# EAGLE design car (EAGLE 6.2)
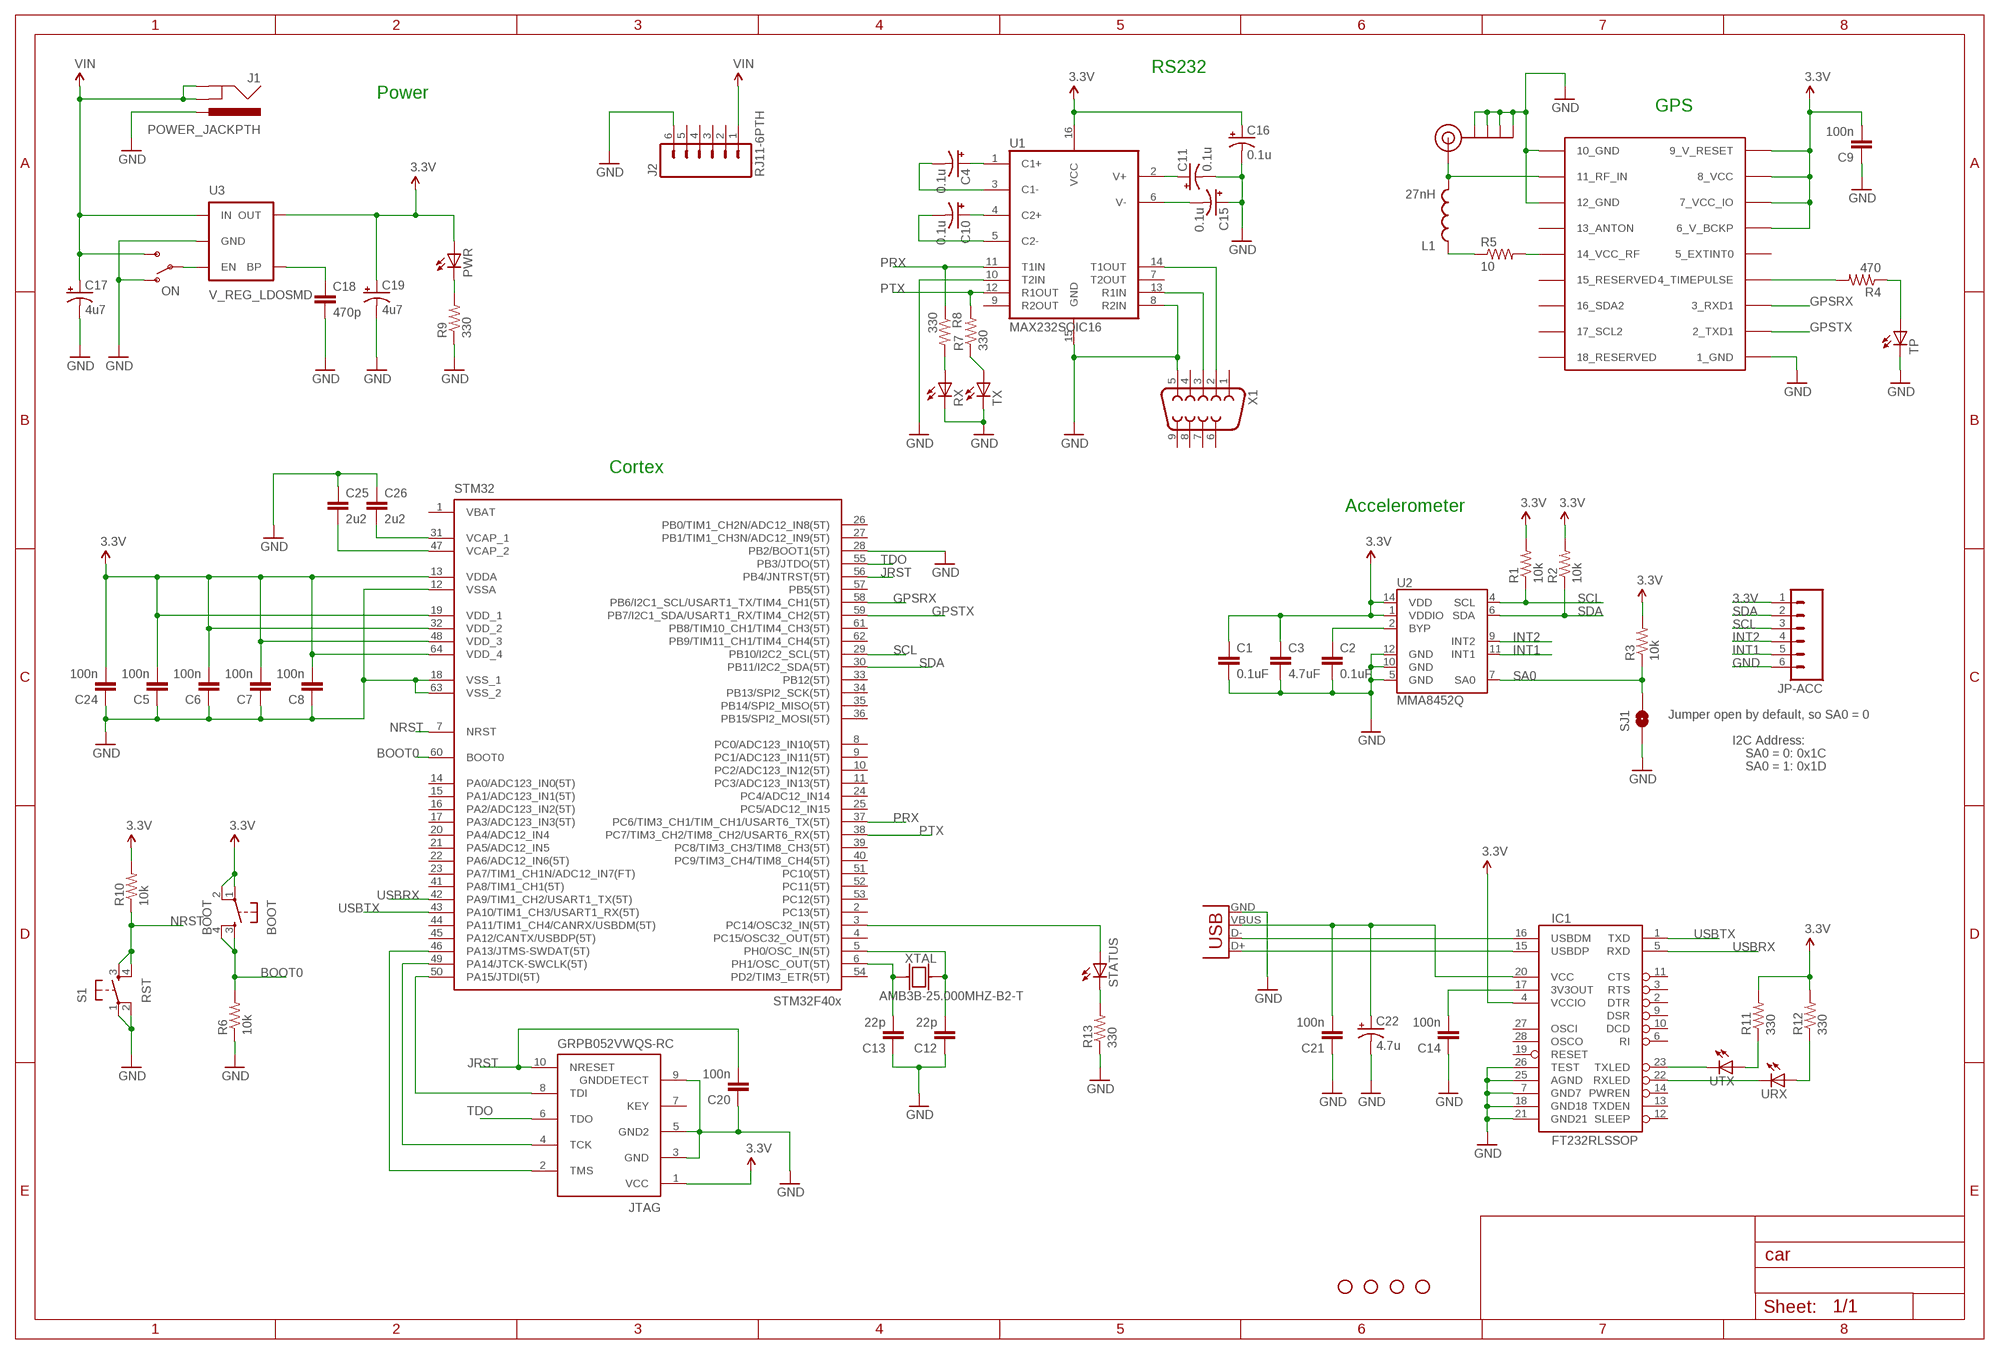
[diagram p0: schematic, sheet 1]

## Parts
BOOT  BOOT  TAC_SWITCHSMD  [TACTILE_SWITCH_SMD]
C1  0.1uF  CAP0603-CAP  [0603-CAP]
C2  0.1uF  CAP0603-CAP  [0603-CAP]
C3  4.7uF  CAP0603-CAP  [0603-CAP]
C4  0.1u  CAP_POL1206  [EIA3216]
C5  100n  CAP0603-CAP  [0603-CAP]
C6  100n  CAP0603-CAP  [0603-CAP]
C7  100n  CAP0603-CAP  [0603-CAP]
C8  100n  CAP0603-CAP  [0603-CAP]
C9  100n  CAP0603-CAP  [0603-CAP]
C10  0.1u  CAP_POL1206  [EIA3216]
C11  0.1u  CAP_POL1206  [EIA3216]
C12  22p  CAP0603-CAP  [0603-CAP]
C13  22p  CAP0603-CAP  [0603-CAP]
C14  100n  CAP0603-CAP  [0603-CAP]
C15  0.1u  CAP_POL1206  [EIA3216]
C16  0.1u  CAP_POL1206  [EIA3216]
C17  4u7  CAP_POL1206  [EIA3216]
C18  470p  CAP0603-CAP  [0603-CAP]
C19  4u7  CAP_POL1206  [EIA3216]
C20  100n  CAP0603-CAP  [0603-CAP]
C21  100n  CAP0603-CAP  [0603-CAP]
C22  4.7u  CAP_POL1206  [EIA3216]
C24  100n  CAP0603-CAP  [0603-CAP]
C25  2u2  CAP0603-CAP  [0603-CAP]
C26  2u2  CAP0603-CAP  [0603-CAP]
IC1  FT232RLSSOP  [SSOP28DB]
J1  POWER_JACKPTH  [POWER_JACK_PTH]
J2  RJ11-6PTH  [RJ11-6]
J$1  SMA_EDGE  [SMA-EDGE]
JP1  STAND-OFF  [STAND-OFF]
JP2  STAND-OFF  [STAND-OFF]
JP3  STAND-OFF  [STAND-OFF]
JP4  STAND-OFF  [STAND-OFF]
JP-ACC  M06SIP  [1X06]
JTAG  GRPB052VWQS-RC  [DEBUG]
L1  27nH  INDUCTOR0603  [0603]
ON  SWITCH-SPDTPTH  [SWITCH-SPDT]
PWR  LED0603  [LED-0603]
R1  10k  RESISTOR0603-RES  [0603-RES]
R2  10k  RESISTOR0603-RES  [0603-RES]
R3  10k  RESISTOR0603-RES  [0603-RES]
R4  470  RESISTOR0603-RES  [0603-RES]
R5  10  RESISTOR0603-RES  [0603-RES]
R6  10k  RESISTOR0603-RES  [0603-RES]
R7  330  RESISTOR0603-RES  [0603-RES]
R8  330  RESISTOR0603-RES  [0603-RES]
R9  330  RESISTOR0603-RES  [0603-RES]
R10  10k  RESISTOR0603-RES  [0603-RES]
R11  330  RESISTOR0603-RES  [0603-RES]
R12  330  RESISTOR0603-RES  [0603-RES]
R13  330  RESISTOR0603-RES  [0603-RES]
RX  LED0603  [LED-0603]
S1  RST  TAC_SWITCHSMD  [TACTILE_SWITCH_SMD]
SJ1  SOLDERJUMPERNO  [SJ_2S-NO]
STATUS  LED0603  [LED-0603]
STM32  STM32F405R  [TQFP64]
TP  LED0603  [LED-0603]
TX  LED0603  [LED-0603]
U1  MAX232SOIC16  [SO016]
U2  MMA8452Q  [QFN-16_0.5MM]
U3  V_REG_LDOSMD  [SOT23-5]
U$1  UBLOX_MAX-6  [UBLOX_MAX-6]
URX  LED0603  [LED-0603]
USB  USB-SMD-NS  [USB-MINIB-NOSTOP]
UTX  LED0603  [LED-0603]
X1  DB9FEMALE  [DB9]
XTAL  AMB3B-25.000MHZ-B2-T  [4LCC]

## Nets
3.3V: BOOT.1 BOOT.2 C1.1 C3.1 C5.2 C6.2 C7.2 C8.2 C9.2 C16.A(+) C19.A(+) C24.2 IC1.4(VCCIO) JP-ACC.1 JTAG.1(VCC) PWR.A R1.2 R2.2 R3.2 R10.2 R11.2 R12.2 STM32.13(VDDA) STM32.19(VDD_1) STM32.32(VDD_2) STM32.48(VDD_3) STM32.64(VDD_4) U1.16(VCC) U2.1(VDDIO) U2.14(VDD) U3.5(OUT) U$1.6_V_BCKP U$1.7_VCC_IO U$1.8_VCC U$1.9_V_RESET
3.3V1: STATUS.A STM32.3(PC14/OSC32_IN(5T))
BOOT0: BOOT.3 BOOT.4 R6.2 STM32.60(BOOT0)
BYP: C2.1 U2.2(BYP)
GND: C1.2 C2.2 C3.2 C5.1 C6.1 C7.1 C8.1 C9.1 C11.C(-) C12.1 C13.1 C14.1 C15.A(+) C16.C(-) C17.C(-) C18.2 C19.C(-) C20.1 C21.1 C22.C(-) C24.1 C25.1 C26.1 IC1.7(GND7) IC1.18(GND18) IC1.21(GND21) IC1.25(AGND) IC1.26(TEST) J1.PWR J2.6 J$1.GND@0(GND) J$1.GND@1(GND) J$1.GND@2(GND) J$1.GND@3(GND) JP-ACC.6 JTAG.3(GND) JTAG.5(GND2) JTAG.9(GNDDETECT) ON.1(O) R6.1 R9.1 R13.1 RX.C S1.1 S1.2 SJ1.1 STM32.12(VSSA) STM32.18(VSS_1) STM32.28(PB2/BOOT1(5T)) STM32.63(VSS_2) TP.C TX.C U1.8(R2IN) U1.10(T2IN) U1.15(GND) U2.5(GND) U2.10(GND) U2.12(GND) U3.2(GND) U$1.1_GND U$1.10_GND U$1.12_GND USB.GND X1.5
GPSRX: STM32.58(PB6/I2C1_SCL/USART1_TX/TIM4_CH1(5T)) U$1.3_RXD1
GPSTX: STM32.59(PB7/I2C1_SDA/USART1_RX/TIM4_CH2(5T)) U$1.2_TXD1
INT1: JP-ACC.5 U2.11(INT1)
INT2: JP-ACC.4 U2.9(INT2)
JRST: C20.2 JTAG.10(NRESET) STM32.56(PB4/JNTRST(5T))
N$1: U1.14(T1OUT) X1.2
N$2: R4.1 TP.A
N$3: R4.2 U$1.4_TIMEPULSE
N$4: C15.C(-) U1.6(V-)
N$5: L1.1 R5.1
N$6: R5.2 U$1.14_VCC_RF
N$7: J$1.SIG(SIGNAL) L1.2 U$1.11_RF_IN
N$8: C12.2 STM32.5(PH0/OSC_IN(5T)) XTAL.3
N$9: PWR.C R9.2
N$10: C11.A(+) U1.2(V+)
N$11: C4.A(+) U1.1(C1+)
N$12: C4.C(-) U1.3(C1-)
N$13: C10.A(+) U1.4(C2+)
N$14: C10.C(-) U1.5(C2-)
N$15: U1.13(R1IN) X1.3
N$16: R7.1 TX.A
N$17: R8.2 RX.A
N$18: C13.2 STM32.6(PH1/OSC_OUT(5T)) XTAL.1
N$19: C18.1 U3.4(BP)
N$20: R13.2 STATUS.C
N$21: C26.2 STM32.31(VCAP_1)
N$22: ON.2(P) U3.3(EN)
N$29: IC1.16(USBDM) USB.D-
N$56: IC1.15(USBDP) USB.D+
N$57: C21.2 C22.A(+) IC1.20(VCC) USB.VBUS
N$58: IC1.23(TXLED) UTX.C
N$59: IC1.22(RXLED) URX.C
N$60: R11.1 UTX.A
N$61: R12.1 URX.A
N$64: C25.2 STM32.47(VCAP_2)
N$69: C14.2 IC1.17(3V3OUT)
NRST: R10.1 S1.3 S1.4 STM32.7(NRST)
PRX: R8.1 STM32.37(PC6/TIM3_CH1/TIM_CH1/USART6_TX(5T)) U1.11(T1IN)
PTX: R7.2 STM32.38(PC7/TIM3_CH2/TIM8_CH2/USART6_RX(5T)) U1.12(R1OUT)
SA0: R3.1 SJ1.2 U2.7(SA0)
SCL: JP-ACC.3 R1.1 STM32.29(PB10/I2C2_SCL(5T)) U2.4(SCL)
SDA: JP-ACC.2 R2.1 STM32.30(PB11/I2C2_SDA(5T)) U2.6(SDA)
TCK: JTAG.4(TCK) STM32.49(PA14/JTCK-SWCLK(5T))
TDI: JTAG.8(TDI) STM32.50(PA15/JTDI(5T))
TDO: JTAG.6(TDO) STM32.55(PB3/JTDO(5T))
TMS: JTAG.2(TMS) STM32.46(PA13/JTMS-SWDAT(5T))
USBRX: IC1.5(RXD) STM32.42(PA9/TIM1_CH2/USART1_TX(5T))
USBTX: IC1.1(TXD) STM32.43(PA10/TIM1_CH3/USART1_RX(5T))
VIN: C17.A(+) J1.GND J1.GNDBREAK J2.1 ON.3(S) U3.1(IN)
Unconnected: IC1.2(DTR) IC1.3(RTS) IC1.6(RI) IC1.9(DSR) IC1.10(DCD) IC1.11(CTS) IC1.12(SLEEP) IC1.13(TXDEN) IC1.14(PWREN) IC1.19(RESET) IC1.27(OSCI) IC1.28(OSCO) J2.2 J2.3 J2.4 J2.5 JTAG.7(KEY) STM32.1(VBAT) STM32.2(PC13(5T)) STM32.4(PC15/OSC32_OUT(5T)) STM32.8(PC0/ADC123_IN10(5T)) STM32.9(PC1/ADC123_IN11(5T)) STM32.10(PC2/ADC123_IN12(5T)) STM32.11(PC3/ADC123_IN13(5T)) STM32.14(PA0/ADC123_IN0(5T)) STM32.15(PA1/ADC123_IN1(5T)) STM32.16(PA2/ADC123_IN2(5T)) STM32.17(PA3/ADC123_IN3(5T)) STM32.20(PA4/ADC12_IN4) STM32.21(PA5/ADC12_IN5) STM32.22(PA6/ADC12_IN6(5T)) STM32.23(PA7/TIM1_CH1N/ADC12_IN7(FT)) STM32.24(PC4/ADC12_IN14) STM32.25(PC5/ADC12_IN15) STM32.26(PB0/TIM1_CH2N/ADC12_IN8(5T)) STM32.27(PB1/TIM1_CH3N/ADC12_IN9(5T)) STM32.33(PB12(5T)) STM32.34(PB13/SPI2_SCK(5T)) STM32.35(PB14/SPI2_MISO(5T)) STM32.36(PB15/SPI2_MOSI(5T)) STM32.39(PC8/TIM3_CH3/TIM8_CH3(5T)) STM32.40(PC9/TIM3_CH4/TIM8_CH4(5T)) STM32.41(PA8/TIM1_CH1(5T)) STM32.44(PA11/TIM1_CH4/CANRX/USBDM(5T)) STM32.45(PA12/CANTX/USBDP(5T)) STM32.51(PC10(5T)) STM32.52(PC11(5T)) STM32.53(PC12(5T)) STM32.54(PD2/TIM3_ETR(5T)) STM32.57(PB5(5T)) STM32.61(PB8/TIM10_CH1/TIM4_CH3(5T)) STM32.62(PB9/TIM11_CH1/TIM4_CH4(5T)) U1.7(T2OUT) U1.9(R2OUT) U$1.5_EXTINT0 U$1.13_ANTON U$1.15_RESERVED U$1.16_SDA2 U$1.17_SCL2 U$1.18_RESERVED X1.1 X1.4 X1.6 X1.7 X1.8 X1.9 XTAL.2(G1) XTAL.4(G2)

## Notes on the sheet
- RS232
- Power
- GPS
- Cortex
- Accelerometer
- Jumper open by default, so SA0 = 0
- I2C Address:
- SA0 = 0: 0x1C
- SA0 = 1: 0x1D

## Library data of the parts
BOOT S1 = SparkFun-Electromechanical:TAC_SWITCH: Momentary Switch Button commonly used for reset or general input. Spark Fun Electronics SKU : COM-00097
C1-C3 = SparkFun:CAP: Capacitor Standard 0603 ceramic capacitor, and 0.1" leaded capacitor.
C4 C10 C11 C15-C17 C19 C22 = SparkFun-Passives:CAP_POL: Capacitor Polarized These are standard SMD and PTH capacitors. Normally 10uF, 47uF, and 100uF in electrolytic and tantalum varieties. Always verify the external diameter of the through hole cap, it varies with capacity, voltage, and manufacturer. The EIA devices should be standard.
C5-C9 C12-C14 C18 C20 C21 C24-C26 = SparkFun-Passives:CAP: Capacitor Standard 0603 ceramic capacitor, and 0.1" leaded capacitor.
IC1 = SparkFun-DigitalIC:FT232RL: USB UART FT232RL 4th Generation USB UART (USB <-> Serial) Controller. Spark Fun Electronics SKU : COM-00650
J1 = SparkFun-Connectors:POWER_JACK: Power Jack This is the standard 5.5mm barrel jack for power. The PTH is the most common, proven, reliable, footprint. All others are experimental. The Slot footprint only works if the mill layer is transmitted to the PCB fab house so be warned. Spark Fun Electronics SKU : PRT-00119. Mating wall wart : TOL-00298 (and others)
J2 = SparkFun-Connectors:RJ11-6: RJ11 Jack Simple 6 pin RJ11 jack. Commonly found on CAT3 devices and Microchip programmers. SKU: PRT-00132
J$1 = SparkFun-Connectors:SMA_EDGE: SMA Antenna Connector End launch SMA connector. The paste layer has been removed so that the connector can be hand soldered onto the board after reflow.
JP1-JP4 = SparkFun-Electromechanical:STAND-OFF: #4 Stand Off This is the mechanical footprint for a #4 phillips button head screw. Use the keepout ring to avoid running the screw head into surrounding components. SKU : PRT-00447
JP-ACC = SparkFun:M06: Header 6 Standard 6-pin 0.1" header. Use with straight break away headers (SKU : PRT-00116), right angle break away headers (PRT-00553), swiss pins (PRT-00743), machine pins (PRT-00117), and female headers (PRT-00115). Molex polarized connector foot print use with SKU : PRT-08094 with associated crimp pins and housings. NOTES ON THE VARIANTS LOCK and LOCK_LONGPADS... This footprint was designed to help hold the alignment of a through-hole component (i.e. 6-pin header) while soldering it into place. You may notice that each hole has been shifted either up or down by 0.005 of an inch from it's more standard position (which is a perfectly straight line). This slight alteration caused the pins (the squares in the middle) to touch the edges of the holes. Because they are alternating, it causes a "brace" to hold the component in place. 0.005 has proven to be the perfect amount of "off-center" position when using our standard breakaway headers. Although looks a little odd when you look at the bare footprint, once you have a header in there, the alteration is very hard to notice. Also, if you push a header all the way into place, it is covered up entirely on the bottom side. This idea of altering the position of holes to aid alignment will be further integrated into the Sparkfun Library for other footprints. It can help hold any component with 3 or more connection pins.
JTAG = stm32f4:GRPB052VWQS-RC: CONN HEADER 0.050" 10PS DL SMD AU reviewed: YES tested: YES
L1 = SparkFun-Passives:INDUCTOR: Inductors Basic Inductor/Choke - 0603 and 1206. Footprints are not proven and vary greatly between part numbers.
ON = SparkFun-Electromechanical:SWITCH-SPDT: SPST Switch Simple slide switch. Spark Fun Electronics SKU : COM-00102
PWR RX STATUS TP TX URX UTX = SparkFun-LED:LED: LEDs Standard schematic elements and footprints for 5mm, 3mm, 1206, and 0603 sized LEDs. 5mm - Spark Fun Electronics SKU : COM-00529 (and others)
R1-R3 R11 R12 = SparkFun:RESISTOR: Resistor Basic schematic elements and footprints for 0603, 1206, and PTH resistors.
R4-R10 R13 = SparkFun-Passives:RESISTOR: Resistor Basic schematic elements and footprints for 0603, 1206, and PTH resistors.
SJ1 = SparkFun:SOLDERJUMPER: Solder Jumper Standard SMD solder jumper. Used to automate production. Two varients : Normally Open and Normally Closed are the same, but have different paste layers. NC will have a large amount of paste and should jumper during reflow.
STM32 = stm32f4:STM32F405R: STM32F405 64 pin LQFP reviewed: YES tested: YES
U1 = SparkFun-DigitalIC:MAX232: RS232 Transceiver Very common IC. This is generically called 'MAX232', but works with the 3V equivalent MAX3232 generic ICs. Field tested and mother approved. Spark Fun Electronics SKU : COM-00316 (DIP) and COM-00589 (SMD)
U2 = SparkFun:MMA8452Q: MMA8452Q 3-Axis, 12/8-bit Digital Accelerometer Supply Voltage: 1.6-3.6V Range: +/- 2g, 4g, 8g Interface: I2C, 12-bit and 8-bit ODR: 1.56 Hz - 800 Hz Package: QFN-16 http://cache.freescale.com/files/sensors/doc/data_sheet/MMA8452Q.pdf
U3 = SparkFun-PowerIC:V_REG_LDO: Voltage Regulator LDO Standard 150mA LDO voltage regulator in SOT-23 layout. Micrel part MIC5205. BP (by-pass) pin is used to lower output noise with 470pF cap.
U$1 = Ava:UBLOX_MAX-6: UBLOX MAX-6
USB = SparkFun-Connectors:USB: USB Connectors USB-B-PTH is fully proven SKU : PRT-00139 USB-miniB is fully proven SKU : PRT-00587 USB-A-PCB is untested. USB-A-H is throughly reviewed, but untested. Spark Fun Electronics SKU : PRT-00437 USB-B-SMT is throughly reviewed, but untested. Needs silkscreen touching up. USB-A-S has not been used/tested USB-MB-H has not been used/tested
X1 = SparkFun-Connectors:DB9: DB9 Connector Standard DB9 (D-Sub 9) serial connector. Can be used for CAN bus as well as RS485 and RS232. Footprint production proven. Spark Fun Electronics SKU : PRT-00429
XTAL = stm32f4:AMB3B-25.000MHZ-B2-T: CRYSTAL, 25.000MHZ 18PF SMD reviewed: YES tested: YES

## Board
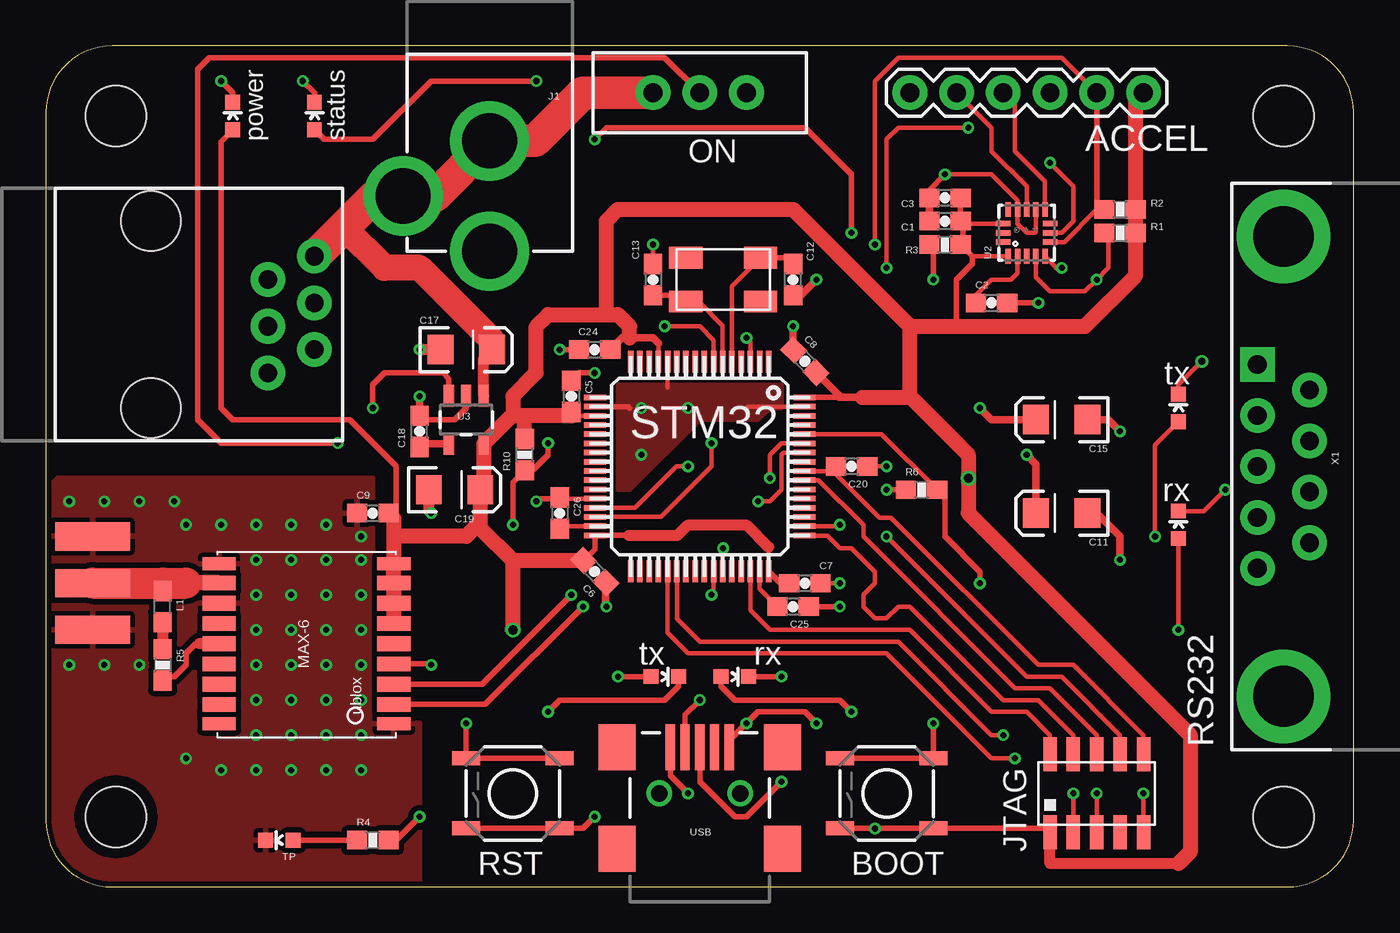
[diagram p1: board, top side]
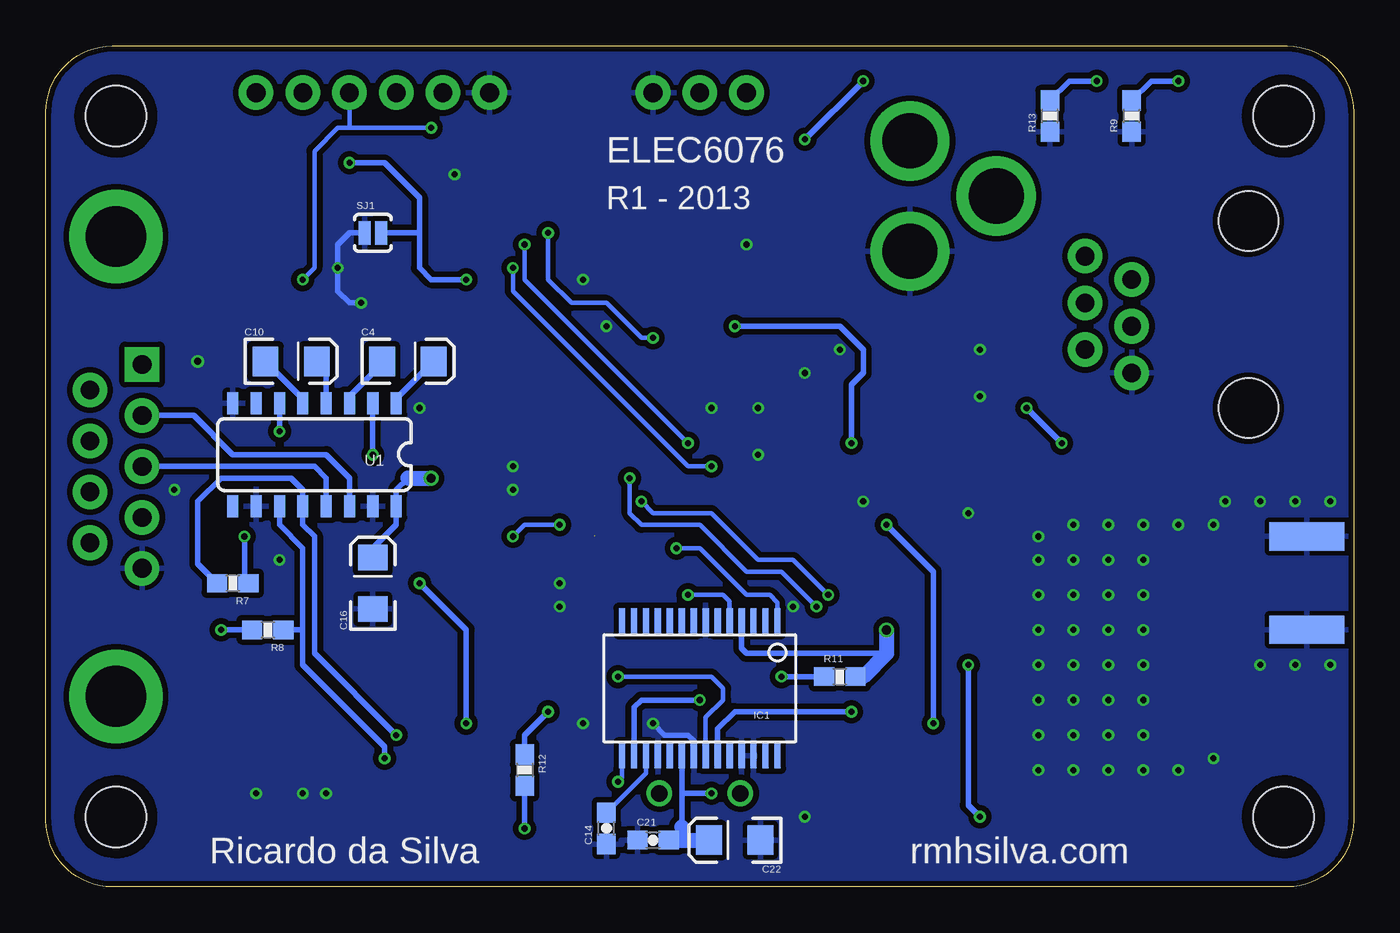
[diagram p2: board, bottom side, seen from below]

Size 71.12 x 45.72 mm. Coordinates in mm from the lower left corner, seen from the top.
Outline: 3.59,0 67.53,0 arc90 71.12,3.59 71.12,42.13 arc90 67.53,45.72 3.59,45.72 arc90 0,42.13 0,3.59 arc90 3.59,0
Copper layers (1*16): Top 0.035mm / dielectric 1.5mm / Bottom 0.035mm
Design rules: minimum track width 6mil, minimum drill 12mil, track to track 6mil, track to pad 6mil, pad to pad 6mil, via to via 6mil, smd to smd 0mil, copper to edge 10mil, drill to drill 10mil, minimum pad ring 10mil, minimum via ring 6mil, stop-mask expansion 2mil, vias tented up to drill 100mil, thermal gap 10mil

### Footprints (pad centres in the part's own frame; a part is rotated, then mirrored left to right if it is on the bottom)
TACTILE_SWITCH_SMD = smd 1.524 x 0.762: 1 -2.54,1.905; 2 2.54,1.905; 3 -2.54,-1.905; 4 2.54,-1.905
0603-CAP = smd 1.1 x 1: 1 -0.85,0; 2 0.85,0
EIA3216 = smd 1.4 x 1.6: A 1.4,0; C -1.4,0
SSOP28DB = smd 0.348 x 1.397: 1 -4.225,-3.656; 2 -3.575,-3.656; 3 -2.925,-3.656; 4 -2.275,-3.656; 5 -1.625,-3.656; 6 -0.975,-3.656; 7 -0.325,-3.656; 8 0.325,-3.656; 9 0.975,-3.656; 10 1.625,-3.656; 11 2.275,-3.656; 12 2.925,-3.656; 13 3.575,-3.656; 14 4.225,-3.656; 15 4.225,3.656; 16 3.575,3.656; 17 2.925,3.656; 18 2.275,3.656; 19 1.625,3.656; 20 0.975,3.656; 21 0.325,3.656; 22 -0.325,3.656; 23 -0.975,3.656; 24 -1.625,3.656; 25 -2.275,3.656; 26 -2.925,3.656; 27 -3.575,3.656; 28 -4.225,3.656
POWER_JACK_PTH = drill 2.997 pad 4.318: GND 0,7.7; GNDBREAK 4.7,10.7; PWR 0,13.7
RJ11-6 = drill 1.016 pad 1.88: 1 1.905,8.89; 2 3.175,6.35; 3 4.445,8.89; 4 5.715,6.35; 5 6.985,8.89; 6 8.255,6.35 | hole 3.251: 0,0; 10.16,0
SMA-EDGE = smd 1.524 x 4.064: GND@0 0,0; GND@1 5.08,0; SIG 2.54,0 | smd 1.524 x 4.064 bottom: GND@2 0,0; GND@3 5.08,0
STAND-OFF = hole 3.302: 0,0
1X06 = drill 1.016 pad 1.88: 1 0,0; 2 2.54,0; 3 5.08,0; 4 7.62,0; 5 10.16,0; 6 12.7,0
DEBUG = smd 1.854 x 0.737: 1 -2.121,2.54; 2 2.121,2.54; 3 -2.121,1.27; 4 2.121,1.27; 5 -2.121,0; 6 2.121,0; 7 -2.121,-1.27; 8 2.121,-1.27; 9 -2.121,-2.54; 10 2.121,-2.54
0603 = smd 1.1 x 1: 1 -0.85,0; 2 0.85,0
SWITCH-SPDT = drill 1.016 pad 1.88: 1 0,2.54; 2 0,0; 3 0,-2.54
LED-0603 = smd 0.8 x 0.8: A 0,-0.75; C 0,0.75
0603-RES = smd 1.1 x 1: 1 -0.85,0; 2 0.85,0
SJ_2S-NO = smd 0.635 x 1.27: 1 -0.45,0; 2 0.45,0
TQFP64 = smd 1.2 x 0.3: 1 -5.7,3.75; 2 -5.7,3.25; 3 -5.7,2.75; 4 -5.7,2.25; 5 -5.7,1.75; 6 -5.7,1.25; 7 -5.7,0.75; 8 -5.7,0.25; 9 -5.7,-0.25; 10 -5.7,-0.75; 11 -5.7,-1.25; 12 -5.7,-1.75; 13 -5.7,-2.25; 14 -5.7,-2.75; 15 -5.7,-3.25; 16 -5.7,-3.75; 33 5.7,-3.75; 34 5.7,-3.25; 35 5.7,-2.75; 36 5.7,-2.25; 37 5.7,-1.75; 38 5.7,-1.25; 39 5.7,-0.75; 40 5.7,-0.25; 41 5.7,0.25; 42 5.7,0.75; 43 5.7,1.25; 44 5.7,1.75; 45 5.7,2.25; 46 5.7,2.75; 47 5.7,3.25; 48 5.7,3.75 | smd 0.3 x 1.2: 17 -3.75,-5.7; 18 -3.25,-5.7; 19 -2.75,-5.7; 20 -2.25,-5.7; 21 -1.75,-5.7; 22 -1.25,-5.7; 23 -0.75,-5.7; 24 -0.25,-5.7; 25 0.25,-5.7; 26 0.75,-5.7; 27 1.25,-5.7; 28 1.75,-5.7; 29 2.25,-5.7; 30 2.75,-5.7; 31 3.25,-5.7; 32 3.75,-5.7; 49 3.75,5.7; 50 3.25,5.7; 51 2.75,5.7; 52 2.25,5.7; 53 1.75,5.7; 54 1.25,5.7; 55 0.75,5.7; 56 0.25,5.7; 57 -0.25,5.7; 58 -0.75,5.7; 59 -1.25,5.7; 60 -1.75,5.7; 61 -2.25,5.7; 62 -2.75,5.7; 63 -3.25,5.7; 64 -3.75,5.7
SO016 = smd 0.6 x 1.2: 1 -4.445,-2.8; 2 -3.175,-2.8; 3 -1.905,-2.8; 4 -0.635,-2.8; 5 0.635,-2.8; 6 1.905,-2.8; 7 3.175,-2.8; 8 4.445,-2.8; 9 4.445,2.8; 10 3.175,2.8; 11 1.905,2.8; 12 0.635,2.8; 13 -0.635,2.8; 14 -1.905,2.8; 15 -3.175,2.8; 16 -4.445,2.8
QFN-16_0.5MM = smd 0.8 x 0.3: 1 -1.275,1; 2 -1.275,0.5; 3 -1.275,0; 4 -1.275,-0.5; 5 -1.275,-1; 9 1.275,-1; 10 1.275,-0.5; 11 1.275,0; 12 1.275,0.5; 13 1.275,1 | smd 0.3 x 0.8: 6 -0.5,-1.275; 7 0,-1.275; 8 0.5,-1.275; 14 0.5,1.275; 15 0,1.275; 16 -0.5,1.275
SOT23-5 = smd 0.55 x 1.2: 1 -0.95,-1.3; 2 0,-1.3; 3 0.95,-1.3; 4 0.95,1.3; 5 -0.95,1.3
UBLOX_MAX-6 = smd 1.8 x 0.7: 1_GND 4.95,-4.4; 9_V_RESET 4.95,4.3; 10_GND -4.55,4.3; 18_RESERVED -4.55,-4.4 | smd 1.8 x 0.8: 2_TXD1 4.95,-3.35; 3_RXD1 4.95,-2.25; 4_TIMEPULSE 4.95,-1.15; 5_EXTINT0 4.95,-0.05; 6_V_BCKP 4.95,1.05; 7_VCC_IO 4.95,2.15; 8_VCC 4.95,3.25; 11_RF_IN -4.55,3.25; 12_GND -4.55,2.15; 13_ANTON -4.55,1.05; 14_VCC_RF -4.55,-0.05; 15_RESERVED -4.55,-1.15; 16_SDA2 -4.55,-2.25; 17_SCL2 -4.55,-3.35
USB-MINIB-NOSTOP = smd 2.5 x 0.5: D+ 2.5,0; D- 2.5,0.8; GND 2.5,-1.6; ID 2.5,-0.8; VBUS 2.5,1.6 | smd 2.5 x 2: G1 -3,-4.5; G2 -3,4.5; G3 2.5,4.5; G4 2.5,-4.5 | drill 0.9 pad 0.8: H1 0,2.2 | drill 0.9 pad 0.787: H2 0,-2.2
DB9 = drill 1.016 pad 1.88 square: 1 -5.54,-1.42 | drill 1.016 pad 1.88: 2 -2.77,-1.42; 3 0,-1.42; 4 2.77,-1.42; 5 5.54,-1.42; 6 -4.15,1.42; 7 -1.38,1.42; 8 1.38,1.42; 9 4.15,1.42 | drill 3.302 pad 5.08: G1 -12.5,0; G2 12.5,0
4LCC = smd 1.803 x 1.194: 1 -2.032,-1.194; 2 2.032,-1.194; 3 2.032,1.194; 4 -2.032,1.194

### Placement (x,y rotation side)
BOOT  45.72,5.08 180 top
C1  48.9,36.2 180 top
C2  51.44,31.75 0 top
C3  48.9,37.47 180 top
C4  51.44,28.57 0 bottom
C5  28.57,26.67 270 top
C6  29.84,17.14 135 top
C7  41.27,16.51 180 top
C8  41.27,28.57 315 top
C9  17.78,20.32 0 top
C10  57.78,28.57 0 bottom
C11  55.24,20.32 180 top
C12  40.64,33.02 90 top
C13  33.02,33.02 270 top
C14  40.64,3.17 90 bottom
C15  55.24,25.4 180 top
C16  53.34,16.51 90 bottom
C17  22.86,29.21 0 top
C18  20.32,24.77 90 top
C19  22.23,21.59 0 top
C20  43.81,22.86 180 top
C21  38.1,2.54 0 bottom
C22  33.66,2.54 180 bottom
C24  29.84,29.21 0 top
C25  40.64,15.24 180 top
C26  27.94,20.32 270 top
IC1  35.56,10.79 180 bottom
J1  24.13,48.26 180 top
J2  5.71,36.2 270 top
J$1  2.54,13.97 90 top
JP1  3.81,3.81 0 top
JP2  67.31,3.81 0 top
JP3  3.81,41.91 0 top
JP4  67.31,41.91 0 top
JP-ACC  59.69,43.18 180 top
JTAG  57.15,5.08 90 top
L1  6.35,15.24 90 top
ON  35.56,43.18 270 top
PWR  10.16,41.91 0 top
R1  58.42,35.56 0 top
R2  58.42,36.83 0 top
R3  48.9,34.92 0 top
R4  17.78,2.54 0 top
R5  6.35,12.06 270 top
R6  47.62,21.59 0 top
R7  60.96,16.51 180 bottom
R8  59.05,13.97 180 bottom
R9  12.06,41.91 90 bottom
R10  26.04,23.5 90 top
R11  27.94,11.43 0 bottom
R12  45.09,6.35 270 bottom
R13  16.51,41.91 90 bottom
RX  61.59,19.68 0 top
S1  25.4,5.08 180 top
SJ1  53.34,35.56 0 bottom
STATUS  14.61,41.91 0 top
STM32  35.56,22.86 270 top
TP  12.7,2.54 90 top
TX  61.59,26.04 0 top
U1  56.52,23.5 180 bottom
U2  53.34,35.56 90 top
U3  22.86,25.4 180 top
U$1  13.97,13.27 0 top
URX  37.47,11.43 270 top
USB  35.56,5.08 90 top
UTX  33.66,11.43 270 top
X1  67.31,22.86 270 top
XTAL  36.83,33.02 0 top

### Tracks (layer width: path | path; a pad name or v marks a point on that pad's centre or on a via)
3.3V  (via drill 0.33, 0.5)
  Top 0.254: U2.14 49.88,36.06 | U2.1 50.38,34.28 | STM32.19 28.57,25.61 | STM32.13 33.31,29.55 | STM32.48 39.31,18.48
  Top 0.305: C3.1 C1.1 49.88,36.06 49.88,35.06 R3.2 50.38,34.28 50.38,33.88 49.53,33.02 49.53,30.48 | 25.48,25.61 25.4,25.69 | C5.2 28.57,25.61 | BOOT.2 v45.09,3.17 BOOT.1 54.39,3.17 JTAG.1 | C7.2 39.96,16.51 STM32.48 | C9.2 19.05,20.74 19.05,22.86 16.51,25.4 10.16,25.4 9.53,26.04 9.53,40.52 PWR.A | C6.2 29.86,18.36 STM32.32 31.69,19.11 | STM32.64 43.12,26.61
  Top 0.406: 18.92,20.03 C9.2 | C24.2 31.33,29.84 31.75,29.84 33.02,29.84 33.31,29.55 | 44.39,26.61 43.12,26.61 43.12,26.73 C8.2
  Top 0.61: 31.69,19.11 34.35,19.11 34.92,19.68 38.1,19.68 39.31,18.48 | 61.59,1.27 54.61,1.27 JTAG.1
  Top 0.813: 28.57,25.61 26.04,25.61 | 26.04,25.61 25.48,25.61 | R10.2 26.04,25.61 | 30.48,31.11 27.3,31.11 26.67,30.48 26.67,27.94 25.4,26.67 25.4,25.69 U3.5 23.81,21.77 C19.A | 30.48,31.11 31.11,31.11 31.75,30.48 31.75,29.84 | 18.92,20.03 18.92,19.05 | 18.92,19.05 U$1.9_V_RESET U$1.8_VCC U$1.7_VCC_IO U$1.6_V_BCKP | 30.48,31.11 30.48,36.2 31.11,36.83 40.64,36.83 46.99,30.48 | 44.39,26.61 46.93,26.61 | 46.93,26.61 46.99,26.67 46.99,30.48 | 46.99,30.48 49.53,30.48 56.52,30.48 59.27,33.23 R1.2 R2.2 59.27,42.76 JP-ACC.1 | 46.93,26.61 47.05,26.61 50.16,23.5 v50.16,22.23 50.16,20.32 62.23,8.26 62.23,1.91 61.59,1.27 | 25.37,17.75 25.37,14 v25.4,13.97 | 25.37,17.75 C6.2 | 25.37,17.75 23.62,19.49 C19.A | C19.A 23.62,19.82 22.86,19.05 18.92,19.05
  Bottom 0.305: C16.A 53.34,18.41 52.07,19.68 U1.16 52.07,21.59 51.44,22.23 | IC1.4 33.28,12.96 33.02,12.7 25.4,12.7 | 27.3,11.64 R11.2 26.67,11.43 | R12.2 v45.09,3.17
  Bottom 0.813: v25.4,13.97 25.4,12.7 26.67,11.43 | 51.44,22.23 v50.16,22.23
3.3V1  (via drill 0.33)
  Top 0.254: STM32.3 38.31,29.64 v38.1,29.84
  Top 0.305: v43.81,35.56 43.81,38.73 41.27,41.27 30.48,41.27 v29.84,40.64 | v26.67,43.81 20.95,43.81 17.78,40.64 15.12,40.64 STATUS.A
  Bottom 0.254: v38.1,29.84 38.73,29.84 40.64,31.75 42.55,31.75 43.81,33.02 v43.81,35.56
  Bottom 0.305: v29.84,40.64 v26.67,43.81
BOOT0  (via drill 0.33)
  Top 0.254: STM32.60 45.45,24.61 R6.2
  Top 0.305: BOOT.4 BOOT.3 v48.26,8.89 | v50.8,16.51 50.8,17.14 48.9,19.05 48.9,21.17 R6.2
  Bottom 0.305: v48.26,8.89 48.26,13.97 v50.8,16.51
BYP
  Top 0.254: U2.2 52.84,33.37 52.49,33.02 51.44,33.02 50.59,32.17
  Top 0.305: 50.8,31.75 C2.1 50.59,32.17
GND  (via drill 0.33, 0.38)
  Top 0.254: 54.97,33.66 U2.5 | STM32.28 27.94,21.11 | C7.1 v43.18,16.51 | C20.1 v45.72,22.86 | STM32.12 33.81,27.15 | C13.1 v33.02,34.92 | JTAG.3 v55.88,5.08 | JTAG.5 v57.15,5.08 | JTAG.9 v59.69,5.08 | STM32.63 38.17,26.11 38.1,26.04 | v48.9,38.73 51.44,38.73 52.84,37.33 U2.12 52.84,36.06 53.34,35.56 SJ1.1 53.84,35.61 U2.10 | TX.C 61.59,27.3 v62.87,28.57 | RX.C 62.98,20.43 v64.14,21.59
  Top 0.305: v55.24,33.66 54.97,33.66 | v53.98,31.75 C2.2 | S1.2 S1.1 29.21,3.17 v29.84,3.81 | C26.1 27.94,21.11 26.82,21.11 v26.67,20.95 | USB.GND 37.16,7.95 v38.1,8.89 38.73,9.53 41.27,9.53 v41.91,8.89 | C25.1 v43.18,15.24 | C24.1 v27.94,29.21 | v29.84,27.94 29,27.94 C5.1 | U3.2 22.86,26.04 22.23,25.4 20.54,25.4 | C11.C 57.15,20.32 | C3.2 48.05,37.88 v48.9,38.73 | STM32.18 31.68,26.11 31.75,26.04 | R6.1 v45.72,21.59
  Top 0.406: C18.2 20.32,25.4 | C18.2 v20.32,26.67 | 20.54,25.4 C18.2 | 57.15,20.32 58.42,19.05 v58.42,17.78 | v40.64,30.48 40.64,29.21 C8.1 | C3.2 C1.2 | C15.A 51.44,25.4 v50.8,26.04 | C6.1 30.45,15.27 v30.48,15.24 | C12.1 41.06,32.17 v41.91,33.02
  Top 0.61: C19.C 20.82,20.45 v20.95,20.32 | C17.C v20.32,29.21
  Bottom 0.305: SJ1.1 54.61,35.56 55.24,34.92 v55.24,33.66 55.24,32.38 54.61,31.75 v53.98,31.75 | IC1.18 37.84,7.36 | IC1.21 35.88,7.95 36.2,8.26 37.47,8.26 v38.1,8.89
  other vias: 11.43,8.26 11.43,10.16 11.43,13.97 11.43,12.06 11.43,15.88 11.43,17.78 1.27,20.95 3.17,20.95 5.08,20.95 6.99,20.95 7.62,19.68 9.53,19.68 11.43,19.68 13.34,19.68 15.24,19.68 17.14,8.26 17.14,10.16 17.14,13.97 17.14,12.06 17.14,15.88 17.14,17.78 17.14,6.35 15.24,6.35 13.34,6.35 11.43,6.35 9.53,6.35 13.34,8.26 13.34,10.16 13.34,13.97 13.34,12.06 13.34,15.88 13.34,17.78 15.24,8.26 15.24,10.16 15.24,13.97 15.24,12.06 15.24,15.88 15.24,17.78 1.27,12.06 3.17,12.06 5.08,12.06 7.62,6.99 32.38,26.04 34.92,26.04 32.38,23.5 17.14,19.05
  pour Top (isolate 0.305): 0,21.59 0,0 20.32,0 20.32,8.89 17.78,8.89 17.78,22.23 0.64,22.23
  pour Bottom (isolate 0.305): 0,2.54 0,43.81 2.54,45.72 68.58,45.72 71.12,43.18 71.12,2.54 68.58,0 2.54,0
  pour Top: 31.11,27.3 40.01,27.3 40.01,26.04 39.37,26.04 38.73,25.4 35.56,25.4 31.75,21.59 31.11,21.59
GPSRX  (via drill 0.33)
  Top 0.254: STM32.58 40.12,23.61 40.01,23.5 40.01,21.59 39.37,20.95 v38.73,20.95
  Top 0.305: U$1.3_RXD1 23.72,11.02 v28.57,15.88
  Bottom 0.254: v28.57,15.88 30.48,17.78 32.38,17.78 34.92,20.32 38.1,20.32 v38.73,20.95
GPSTX  (via drill 0.33)
  Top 0.254: STM32.59 arc90 41.24,24.13 40.01,24.13 39.37,23.5 v39.37,22.23
  Top 0.305: U$1.2_TXD1 23.89,9.92 v29.21,15.24
  Bottom 0.254: v29.21,15.24 31.11,17.14 33.02,17.14 35.56,19.68 38.73,19.68 39.37,20.32 v39.37,22.23
INT1
  Top 0.254: U2.11 53.34,38.1 51.44,40.01 51.44,41.27 JP-ACC.5
INT2
  Top 0.254: U2.9 54.34,38.37 52.7,40.01 52.7,42.55 JP-ACC.4
JRST
  Top 0.254: JTAG.10 59.69,8.26 55.88,12.06 53.98,12.06 45.97,20.07 45.34,20.07 42.8,22.61 STM32.56
  Top 0.305: C20.2 42.97,22.78 42.8,22.61
N$1
  Bottom 0.305: X1.2 63.09,25.63 60.96,23.5 55.88,23.5 54.61,22.23 U1.14
N$2
  Top 0.305: R4.1 TP.A
N$3  (via drill 0.33)
  Top 0.305: U$1.4_TIMEPULSE 20.9,12.12 v20.95,12.06 | v20.32,3.81 19.05,2.54 R4.2
  Bottom 0.305: v20.95,12.06 20.95,4.45 v20.32,3.81
N$4  (via drill 0.33)
  Top 0.406: C15.C 57.78,25.4 v58.42,24.77
  Bottom 0.305: U1.6 v58.42,24.77
N$5
  Top 0.61: L1.1 R5.1
N$6
  Top 0.305: R5.2 6.57,11.43 6.99,11.43 7.62,12.06 7.62,12.7 8.14,13.22 8.36,13.22
  Top 0.61: U$1.14_VCC_RF 8.36,13.22
N$7
  Top 0.406: L1.2 6.35,16.51
  Top 0.813: U$1.11_RF_IN 7.62,16.52 7.62,16.51
  Top 1.676: J$1.SIG 6.35,16.51 7.62,16.51
N$8
  Top 0.254: STM32.5 37.31,32.66 XTAL.3
  Top 0.305: XTAL.3 40.3,34.21 C12.2
N$9  (via drill 0.33)
  Top 0.305: PWR.C 10.16,43.18 v9.53,43.81
  Bottom 0.305: v9.53,43.81 11.01,43.81 R9.2
N$10  (via drill 0.33)
  Top 0.406: C11.A 53.84,22.99 v53.34,23.5
  Bottom 0.305: v53.34,23.5 U1.2
N$11
  Bottom 0.305: U1.1 52.07,26.54 C4.A
N$12
  Bottom 0.305: C4.C 52.84,28.45 54.61,26.67 U1.3
N$13
  Bottom 0.305: U1.4 55.88,28.07 C10.A
N$14
  Bottom 0.305: U1.5 57.15,26.54 C10.C
N$15
  Bottom 0.305: X1.3 56.52,22.86 55.88,22.23 U1.13
N$16  (via drill 0.33)
  Top 0.254: v60.33,19.05 60.33,24.02 TX.A
  Bottom 0.305: v60.33,19.05 60.33,16.73 R7.1
N$17  (via drill 0.33)
  Top 0.254: RX.A v61.59,13.97
  Bottom 0.305: R8.2 v61.59,13.97
N$18
  Top 0.254: STM32.6 36.81,30.5 35.56,31.75
  Top 0.305: C13.2 34.45,32.17 XTAL.1 34.87,31.75 35.56,31.75
N$19
  Top 0.406: U3.4 20.5,24.1 C18.1
N$20  (via drill 0.33)
  Top 0.305: STATUS.C 14.61,43.18 v13.97,43.81
  Bottom 0.305: v13.97,43.81 15.46,43.81 R13.2
N$21
  Top 0.254: STM32.31 28.08,19.61
  Top 0.305: 28.08,19.61 C26.2
N$22  (via drill 0.33)
  Top 0.305: U3.3 21.91,27.62 21.59,27.94 18.41,27.94 17.78,27.3 v17.78,26.04 | ON.2 33.66,45.09 8.89,45.09 8.26,44.45 8.26,25.4 9.53,24.13 v15.88,24.13
  Bottom 0.305: v15.88,24.13 v17.78,26.04
N$29  (via drill 0.33)
  Top 0.305: USB.D- 34.76,9.36 v35.56,10.16
  Bottom 0.305: IC1.16 39.13,9.76 38.73,10.16 v35.56,10.16
N$56  (via drill 0.33)
  Top 0.305: USB.D+ 35.56,5.71 37.47,3.81 38.1,3.81 v40.01,5.71
  Bottom 0.254: IC1.15 39.78,5.93 v40.01,5.71
N$57  (via drill 0.33)
  Top 0.305: 33.96,7.95 USB.VBUS 33.96,6.04 v34.92,5.08
  Bottom 0.305: IC1.20 36.53,5.08 | 36.53,5.08 36.53,3.25 | v34.92,5.08 36.53,5.08
  Bottom 0.813: 36.83,2.54 C22.A | 36.53,3.25 36.53,2.83 36.83,2.54 | 36.83,2.54 C21.2
N$58  (via drill 0.33)
  Top 0.305: UTX.C 34.41,10.91 33.66,10.16 27.94,10.16 v27.3,9.53
  Bottom 0.305: IC1.23 34.59,8.6 33.66,9.53 v27.3,9.53
N$59  (via drill 0.33)
  Top 0.305: URX.C v40.01,11.43
  Bottom 0.254: v40.01,11.43 34.92,11.43 34.29,10.79 34.29,10.16 35.23,9.21 IC1.22
N$60  (via drill 0.33)
  Top 0.305: UTX.A v31.11,11.43
  Bottom 0.305: R11.1 v31.11,11.43
N$61  (via drill 0.33)
  Top 0.305: URX.A 36.72,10.91 37.47,10.16 43.18,10.16 v43.81,9.53
  Bottom 0.305: R12.1 45.09,8.26 v43.81,9.53
N$64
  Top 0.254: STM32.47 38.81,16.22 C25.2
N$69
  Bottom 0.254: IC1.17 38.48,6.18 C14.2
NRST  (via drill 0.33)
  Top 0.254: STM32.7 36.31,29.73 35.56,30.48 v33.66,30.48
  Top 0.305: S1.3 S1.4 v22.86,8.89 | v25.4,19.68 25.4,22.01 R10.1 26.45,22.64 27.3,23.5 v27.3,24.13
  Bottom 0.305: v27.3,24.13 27.3,27.3 26.67,27.94 26.67,29.21 27.94,30.48 v33.66,30.48 | v22.86,8.89 22.86,17.14 v25.4,19.68
PRX  (via drill 0.33)
  Top 0.254: STM32.37 33.81,13.81 34.92,12.7 45.72,12.7 51.44,6.99 v52.7,6.99
  Bottom 0.305: U1.11 58.42,19.68 57.15,18.41 57.15,13.97 | R8.1 57.15,13.97 | 57.15,13.97 57.15,12.06 52.7,7.62 v52.7,6.99
PTX  (via drill 0.33)
  Top 0.254: STM32.38 34.31,14.59 35.56,13.34 46.35,13.34 51.44,8.26 v52.07,8.26
  Bottom 0.305: R7.2 62.87,17.57 62.87,20.95 61.59,22.23 57.78,22.23 57.15,21.59 U1.12 57.15,19.68 56.52,19.05 56.52,12.7 v52.07,8.26
SA0  (via drill 0.33)
  Top 0.254: U2.7 55.24,35.56 55.88,36.2 55.88,38.1 v54.61,39.37
  Top 0.305: v48.26,33.02 48.26,34.71 R3.1
  Bottom 0.305: v54.61,39.37 52.7,39.37 50.8,37.47 50.8,35.56 | 50.8,35.56 50.8,33.66 50.16,33.02 v48.26,33.02 | SJ1.2 50.8,35.56
SCL  (via drill 0.33)
  Top 0.254: U2.4 53.84,33.16 54.61,32.38 56.52,32.38 v57.15,33.02 57.78,33.66 57.78,35.34 | v45.72,33.66 45.72,40.64 46.35,41.27 v50.16,41.27 | STM32.29 32.04,20.61 34.29,22.86 v34.92,22.86
  Top 0.305: 57.78,35.34 R1.1
  Bottom 0.254: JP-ACC.3 54.61,41.27 | v57.15,33.02 56.52,33.66 56.52,40.01 55.24,41.27 54.61,41.27 | v45.72,33.66 45.72,32.38 36.2,22.86 v34.92,22.86 | v50.16,41.27 54.61,41.27
SDA  (via drill 0.33)
  Top 0.254: U2.6 55.38,35.06 57.15,36.83 | STM32.30 33.45,20.11 36.2,22.86 v36.2,24.13 | JP-ACC.2 55.24,45.09 46.35,45.09 45.09,43.81 v45.09,34.92
  Top 0.305: R2.1 57.15,36.83 JP-ACC.2
  Bottom 0.254: v45.09,34.92 45.09,33.02 v36.2,24.13
TCK  (1 unrouted)
  Top 0.254: JTAG.4 55.88,8.26 53.98,10.16 52.07,10.16 46.99,15.24 46.35,15.24 45.72,14.61 45.09,14.61 44.45,15.24 44.45,15.88 45.09,16.51 45.09,17.14 43.81,18.41 43.18,18.41 42.5,19.09 41.27,19.09
TDI  (via drill 0.33)
  Top 0.254: JTAG.8 58.42,8.26 55.24,11.43 53.34,11.43 v45.72,19.05 | STM32.50 43.1,19.61 v43.18,19.68
  Bottom 0.254: v43.18,19.68 45.09,19.68 v45.72,19.05
TDO
  Top 0.254: JTAG.6 57.15,8.26 54.61,10.79 52.7,10.79 44.45,19.05 44.45,19.68 42.02,22.11 STM32.55
TMS
  Top 0.254: JTAG.2 54.61,8.26 53.34,9.53 51.44,9.53 46.99,13.97 39.37,13.97 38.31,15.03 STM32.46
USBRX  (via drill 0.33)
  Top 0.254: STM32.42 36.31,15.99 v36.2,15.88
  Bottom 0.254: IC1.5 33.94,15.52 34.29,15.88 v36.2,15.88
USBTX  (via drill 0.33)
  Top 0.254: STM32.43 36.81,18.39 v36.83,18.41
  Bottom 0.254: IC1.1 31.34,15.46 31.75,15.88 33.02,15.88 35.56,18.41 v36.83,18.41
VIN
  Top 0.406: 23.81,28.76 C17.A
  Top 0.61: U3.1 23.81,28.76
  Top 1.422: C17.A 24.26,29.71 20.32,33.66 18.41,33.66 16.19,35.88
  Top 1.778: J2.1 16.19,35.88 17.88,37.56 J1.GNDBREAK 21.13,37.56 J1.GND 26.59,40.56 29.21,43.18 ON.3

### Text on the board
tPlace: power | status | ACCEL | ON | tx | rx | tx | rx | RS232 | RST | BOOT
bPlace: ELEC6076 | R1 - 2013 | rmhsilva.com | Ricardo da Silva